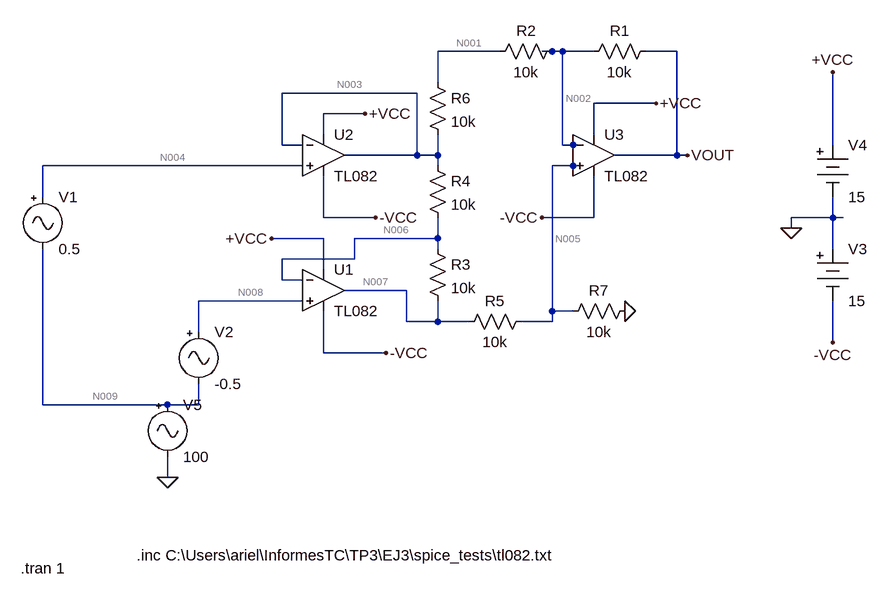
[diagram p0: schematic test03.asc]
test03.asc, the LTspice schematic file:
Version 4
SHEET 1 952 680
WIRE 384 -160 288 -160
WIRE 464 -160 448 -160
WIRE 480 -160 464 -160
WIRE 528 -160 480 -160
WIRE 656 -160 608 -160
WIRE 288 -112 288 -160
WIRE 256 -96 48 -96
WIRE 624 -80 528 -80
WIRE 176 -64 112 -64
WIRE 112 -32 112 -64
WIRE 528 -32 528 -80
WIRE 48 -16 48 -96
WIRE 80 -16 48 -16
WIRE 480 -16 480 -160
WIRE 496 -16 496 -32
WIRE 496 -16 480 -16
WIRE 896 -16 896 -128
WIRE 256 0 256 -96
WIRE 256 0 144 0
WIRE 288 0 288 -32
WIRE 288 0 256 0
WIRE 656 0 656 -160
WIRE 656 0 560 0
WIRE 672 0 656 0
WIRE 80 16 -320 16
WIRE 288 16 288 0
WIRE 496 16 496 0
WIRE 496 16 464 16
WIRE -320 64 -320 16
WIRE 112 96 112 32
WIRE 192 96 112 96
WIRE 528 96 528 32
WIRE 528 96 448 96
WIRE 896 96 896 64
WIRE 896 96 832 96
WIRE 912 96 896 96
WIRE 832 112 832 96
WIRE 112 128 32 128
WIRE 288 128 288 96
WIRE 288 128 160 128
WIRE 288 144 288 128
WIRE 896 144 896 96
WIRE 160 160 160 128
WIRE 160 160 48 160
WIRE 112 176 112 128
WIRE 48 192 48 160
WIRE 80 192 48 192
WIRE 240 208 144 208
WIRE 80 224 -80 224
WIRE 464 240 464 16
WIRE 496 240 464 240
WIRE 240 256 240 208
WIRE 288 256 288 224
WIRE 288 256 240 256
WIRE 336 256 288 256
WIRE 464 256 464 240
WIRE 464 256 416 256
WIRE -80 272 -80 224
WIRE 896 288 896 224
WIRE 112 304 112 240
WIRE 208 304 112 304
WIRE -320 384 -320 144
WIRE -128 384 -320 384
WIRE -80 384 -80 352
WIRE -80 384 -128 384
WIRE -128 496 -128 464
FLAG 176 -64 +VCC
FLAG 192 96 -VCC
FLAG 32 128 +VCC
FLAG 208 304 -VCC
FLAG 448 96 -VCC
FLAG 672 0 VOUT
FLAG 624 -80 +VCC
FLAG 576 240 0
FLAG 832 112 0
FLAG 896 -128 +VCC
FLAG 896 288 -VCC
FLAG -128 496 0
SYMBOL Opamps\\opamp2 112 144 R0
SYMATTR InstName U1
SYMATTR Value TL082
SYMBOL Opamps\\opamp2 112 -64 R0
SYMATTR InstName U2
SYMATTR Value TL082
SYMBOL Opamps\\opamp2 528 -64 R0
SYMATTR InstName U3
SYMATTR Value TL082
SYMBOL res 624 -176 R90
WINDOW 0 0 56 VBottom 2
WINDOW 3 32 56 VTop 2
SYMATTR InstName R1
SYMATTR Value 10k
SYMBOL res 480 -176 R90
WINDOW 0 0 56 VBottom 2
WINDOW 3 32 56 VTop 2
SYMATTR InstName R2
SYMATTR Value 10k
SYMBOL res 432 240 R90
WINDOW 0 0 56 VBottom 2
WINDOW 3 32 56 VTop 2
SYMATTR InstName R5
SYMATTR Value 10k
SYMBOL res 272 128 R0
SYMATTR InstName R3
SYMATTR Value 10k
SYMBOL res 272 0 R0
SYMATTR InstName R4
SYMATTR Value 10k
SYMBOL res 272 -128 R0
SYMATTR InstName R6
SYMATTR Value 10k
SYMBOL Misc\\signal -320 48 R0
WINDOW 123 0 0 Left 2
WINDOW 39 0 0 Left 2
SYMATTR InstName V1
SYMATTR Value 0.5
SYMBOL Misc\\signal -80 256 R0
WINDOW 123 0 0 Left 2
WINDOW 39 0 0 Left 2
SYMATTR InstName V2
SYMATTR Value -0.5
SYMBOL res 592 224 R90
WINDOW 0 0 56 VBottom 2
WINDOW 3 32 56 VTop 2
SYMATTR InstName R7
SYMATTR Value 10k
SYMBOL Misc\\battery 896 128 R0
WINDOW 123 0 0 Left 2
WINDOW 39 0 0 Left 2
SYMATTR InstName V3
SYMATTR Value 15
SYMBOL Misc\\battery 896 -32 R0
WINDOW 123 0 0 Left 2
WINDOW 39 0 0 Left 2
SYMATTR InstName V4
SYMATTR Value 15
SYMBOL Misc\\signal -128 368 R0
WINDOW 123 0 0 Left 2
WINDOW 39 0 0 Left 2
SYMATTR InstName V5
SYMATTR Value 100
TEXT -176 616 Left 2 !.inc C:\\Users\\ariel\\InformesTC\\TP3\\EJ3\\spice_tests\\tl082.txt
TEXT -354 636 Left 2 !.tran 1

The netlist it stands for:
* test03.asc
XU1 N008 N006 +VCC -VCC N007 TL082  ; pins In+ In- V+ V- OUT
XU2 N004 N003 +VCC -VCC N003 TL082  ; pins In+ In- V+ V- OUT
XU3 N005 N002 +VCC -VCC VOUT TL082  ; pins In+ In- V+ V- OUT
R1 VOUT N002 10k
R2 N002 N001 10k
R5 N005 N007 10k
R3 N006 N007 10k
R4 N003 N006 10k
R6 N001 N003 10k
V1 N004 N009 0.5
V2 N008 N009 -0.5
R7 0 N005 10k
V3 0 -VCC 15
V4 +VCC 0 15
V5 N009 0 100
.inc C:\Users\ariel\InformesTC\TP3\EJ3\spice_tests\tl082.txt
.tran 1
.backanno
.end

* Results of the author's LTspice run, read from the files saved beside the schematic
* Operating Point, zero values left out:
*   V(n006) = 13.73 V
*   V(n008) = 99.5 V
*   V(+vcc) = 15 V
*   V(-vcc) = -15 V
*   V(n007) = 13.57 V
*   V(n003) = 13.58 V
*   V(n004) = 100.5 V
*   V(n002) = 6.79 V
*   V(n005) = 6.785 V
*   V(vout) = 3.394 V
*   V(n001) = 10.19 V
*   V(n009) = 100 V
*   I(R7) = -678.5 µA
*   I(R6) = -339.6 µA
*   I(R4) = -14.98 µA
*   I(R3) = 16.27 µA
*   I(R5) = -678.5 µA
*   I(R2) = -339.6 µA
*   I(R1) = -339.6 µA
*   I(V5) = -638.4 pA
*   I(V4) = -7.256 mA
*   I(V3) = -6.577 mA
*   I(V2) = -317.8 pA
*   I(V1) = -320.5 pA
*   Ix(u1:1) = 317.8 pA
*   Ix(u1:2) = -31.25 µA
*   Ix(u1:99) = 2.762 mA
*   Ix(u1:50) = -2.069 mA
*   Ix(u1:28) = -662.2 µA
*   Ix(u2:1) = 320.5 pA
*   Ix(u2:2) = -31.25 µA
*   Ix(u2:99) = 2.393 mA
*   Ix(u2:50) = -2.069 mA
*   Ix(u2:28) = -293.4 µA
*   Ix(u3:1) = 45.82 pA
*   Ix(u3:2) = 95.76 pA
*   Ix(u3:99) = 2.1 mA
*   Ix(u3:50) = -2.44 mA
*   Ix(u3:28) = 339.6 µA